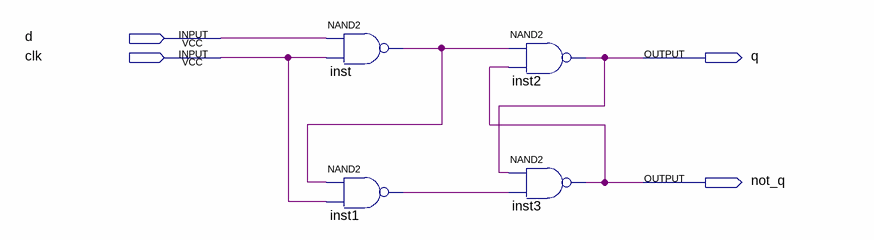
[diagram p0: schematic sheet]
// Quartus schematic D_TR_STATIC.bdf as structural Verilog: 4 symbols, 4 pins
module D_TR_STATIC (
  input  d,
  input  clk,
  output q,
  output not_q
);

  wire inst1_out, inst_out;

  nand inst (inst_out, d, clk);
  nand inst1 (inst1_out, inst_out, clk);
  nand inst2 (q, inst_out, not_q);
  nand inst3 (not_q, q, inst1_out);
endmodule
